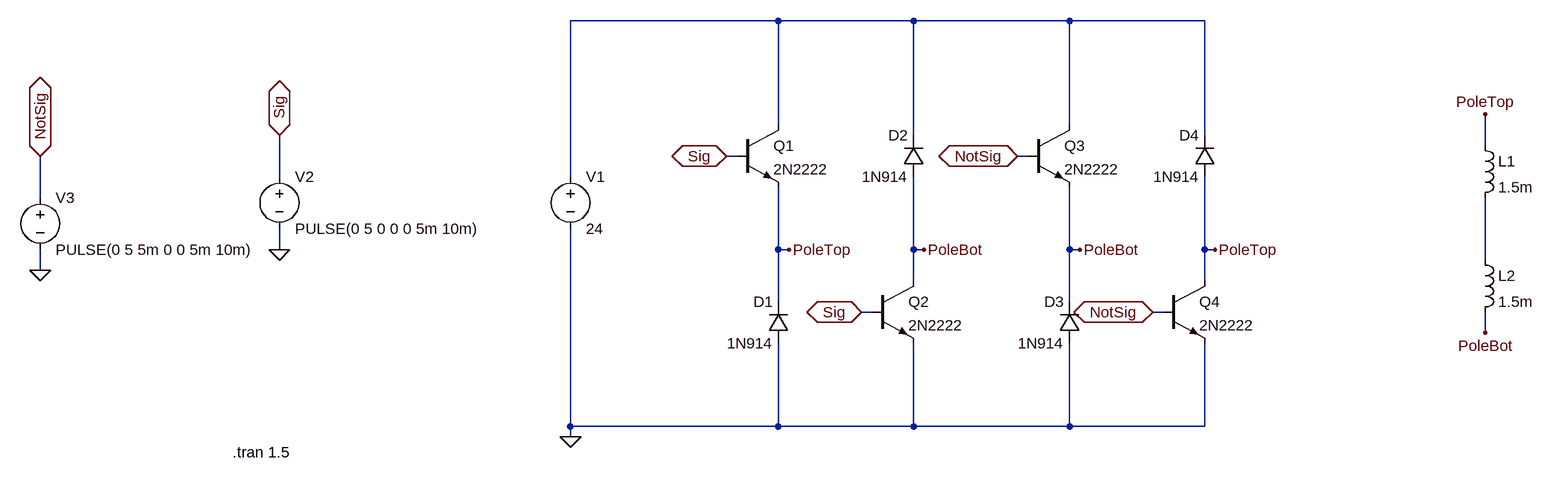
[diagram p0: schematic ElectricalModel.asc]
ElectricalModel.asc, the LTspice schematic file:
Version 4
SHEET 1 1580 1252
WIRE 416 -112 96 -112
WIRE 624 -112 416 -112
WIRE 864 -112 624 -112
WIRE 1072 -112 864 -112
WIRE 416 48 416 -112
WIRE 864 48 864 -112
WIRE 624 64 624 -112
WIRE 1072 64 1072 -112
WIRE 1504 80 1504 32
WIRE 352 96 336 96
WIRE 800 96 784 96
WIRE -352 128 -352 64
WIRE 96 128 96 -112
WIRE -720 160 -720 96
WIRE -352 240 -352 208
WIRE 416 240 416 144
WIRE 432 240 416 240
WIRE 624 240 624 128
WIRE 640 240 624 240
WIRE 864 240 864 144
WIRE 880 240 864 240
WIRE 1072 240 1072 128
WIRE 1088 240 1072 240
WIRE 1504 256 1504 160
WIRE -720 272 -720 240
WIRE 624 288 624 240
WIRE 1072 288 1072 240
WIRE 416 320 416 240
WIRE 864 320 864 240
WIRE 560 336 544 336
WIRE 1008 336 992 336
WIRE 1504 368 1504 336
WIRE 96 512 96 208
WIRE 416 512 416 384
WIRE 416 512 96 512
WIRE 624 512 624 384
WIRE 624 512 416 512
WIRE 864 512 864 384
WIRE 864 512 624 512
WIRE 1072 512 1072 384
WIRE 1072 512 864 512
WIRE 96 528 96 512
FLAG -352 240 0
FLAG -352 64 Sig
IOPIN -352 64 BiDir
FLAG 336 96 Sig
IOPIN 336 96 BiDir
FLAG 544 336 Sig
IOPIN 544 336 BiDir
FLAG 96 528 0
FLAG 432 240 PoleTop
FLAG 640 240 PoleBot
FLAG 1088 240 PoleTop
FLAG 880 240 PoleBot
FLAG 1504 32 PoleTop
FLAG 1504 368 PoleBot
FLAG 784 96 NotSig
IOPIN 784 96 BiDir
FLAG 992 336 NotSig
IOPIN 992 336 BiDir
FLAG -720 272 0
FLAG -720 96 NotSig
IOPIN -720 96 BiDir
SYMBOL voltage 96 112 R0
WINDOW 123 0 0 Left 0
WINDOW 39 0 0 Left 0
SYMATTR InstName V1
SYMATTR Value 24
SYMBOL ind 1488 64 R0
SYMATTR InstName L1
SYMATTR Value 1.5m
SYMATTR SpiceLine Ipk=0.5 Rser=2.064 Rpar=141300 Cpar=0 mfg="Coilcraft" pn="RFB1010-152"
SYMBOL ind 1488 240 R0
SYMATTR InstName L2
SYMATTR Value 1.5m
SYMATTR SpiceLine Ipk=0.5 Rser=2.064 Rpar=141300 Cpar=0 mfg="Coilcraft" pn="RFB1010-152"
SYMBOL npn 352 48 R0
SYMATTR InstName Q1
SYMATTR Value 2N2222
SYMBOL diode 432 384 R180
WINDOW 0 24 64 Left 2
WINDOW 3 24 0 Left 2
SYMATTR InstName D1
SYMATTR Value 1N914
SYMBOL diode 640 128 R180
WINDOW 0 24 64 Left 2
WINDOW 3 24 0 Left 2
SYMATTR InstName D2
SYMATTR Value 1N914
SYMBOL npn 560 288 R0
SYMATTR InstName Q2
SYMATTR Value 2N2222
SYMBOL voltage -352 112 R0
WINDOW 123 0 0 Left 0
WINDOW 39 0 0 Left 0
SYMATTR InstName V2
SYMATTR Value PULSE(0 5 0 0 0 5m 10m)
SYMBOL npn 800 48 R0
SYMATTR InstName Q3
SYMATTR Value 2N2222
SYMBOL diode 880 384 R180
WINDOW 0 24 64 Left 2
WINDOW 3 24 0 Left 2
SYMATTR InstName D3
SYMATTR Value 1N914
SYMBOL diode 1088 128 R180
WINDOW 0 24 64 Left 2
WINDOW 3 24 0 Left 2
SYMATTR InstName D4
SYMATTR Value 1N914
SYMBOL npn 1008 288 R0
SYMATTR InstName Q4
SYMATTR Value 2N2222
SYMBOL voltage -720 144 R0
WINDOW 123 0 0 Left 0
WINDOW 39 0 0 Left 0
SYMATTR InstName V3
SYMATTR Value PULSE(0 5 5m 0 0 5m 10m)
TEXT -424 552 Left 2 !.tran 1.5

The netlist it stands for:
* ElectricalModel.asc
V1 N001 0 24
L1 PoleTop N002 1.5m Ipk=0.5 Rser=2.064 Rpar=141300 Cpar=0 mfg="Coilcraft" pn="RFB1010-152"
L2 N002 PoleBot 1.5m Ipk=0.5 Rser=2.064 Rpar=141300 Cpar=0 mfg="Coilcraft" pn="RFB1010-152"
Q1 N001 Sig PoleTop 0 2N2222
D1 0 PoleTop 1N914
D2 PoleBot N001 1N914
Q2 PoleBot Sig 0 0 2N2222
V2 Sig 0 PULSE(0 5 0 0 0 5m 10m)
Q3 N001 NotSig PoleBot 0 2N2222
D3 0 PoleBot 1N914
D4 PoleTop N001 1N914
Q4 PoleTop NotSig 0 0 2N2222
V3 NotSig 0 PULSE(0 5 5m 0 0 5m 10m)
.model D D
.lib standard.dio
.model NPN NPN
.model PNP PNP
.lib standard.bjt
.tran 1.5
.backanno
.end